# Altium schematic sheet HDC1080.SchDoc
size A4
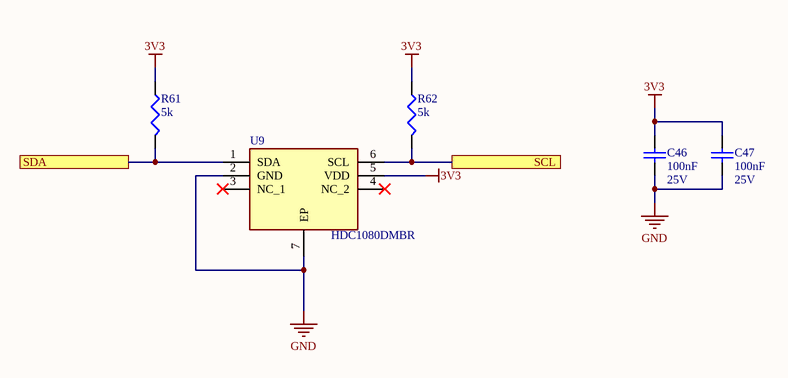
[diagram p0: HDC1080.SchDoc]

## Parts
C46  100nF  Voltage Rating: 25V  [C0402]
C47  100nF  Voltage Rating: 25V  [C0402]
R61  5k  [0402]
R62  5k  [0402]
U9  HDC1080DMBR  [SON100P300X300X80-7N-D]

## Ports
SCL, SDA

## Nets
3V3: C46.2 C47.2 R61.2 R62.2 U9.5(VDD)
GND: C46.1 C47.1 U9.2(GND) U9.7(EP)
SCL: R62.1 U9.6(SCL) ; port SCL
SDA: R61.1 U9.1(SDA) ; port SDA

Not connected (* = marked no-connect by the designer): U9 3(NC_1)* 4(NC_2)*

## Library data of the parts
C46 C47 = 100nF/0402/CER/25V: Capacitor, 100nF, 25V, X7R; Capacitance Tolerance: 10nF; Capacitor Case Style: 0402; Brand Number: GRM155R71E104KE14D; Brand: MULTICOMP; Dielectric Characteristic: X7R; Capacitance: 100nF; Temperature Range: -55 to +125 C; Price: 0,0225; Order Code Supplier: 2456106; Supplier: Farnell
R61 R62 = 10k/0402/0063W/50V: Resistor, 10k, 0.1%, 0.0625W, 50V, 100PPM, 0402; Brand: VISHAY DRALORIC; Brand Number: CRCW040210K0FKED; Power Rating: 0.063W; Case Style: 0402; Order Code Supplier: 2121730; Price: 0,0005; Resistance: 10k; Supplier: Farnell; Temperature Coefficient: ± 100PPM; Temperature Range: -55°C to +125°C; Voltage Rating: 50V
U9 = HDC1080DMBR: Integrated Circuit; Manufacturer_Name: Texas Instruments; Datasheet Link: http://www.ti.com/lit/gpn/HDC1080; Height: 0.8mm; Manufacturer_Part_Number: HDC1080DMBR; Mouser Part Number: 595-HDC1080DMBR; Mouser Price/Stock: https://www.mouser.co.uk/ProductDetail/Texas-Instruments/HDC1080DMBR?qs=8%2FmU9qzJpL9OuhPLRSO9Vg%3D%3D; Arrow Part Number: HDC1080DMBR; Arrow Price/Stock: https://www.arrow.com/en/products/hdc1080dmbr/texas-instruments?region=nac